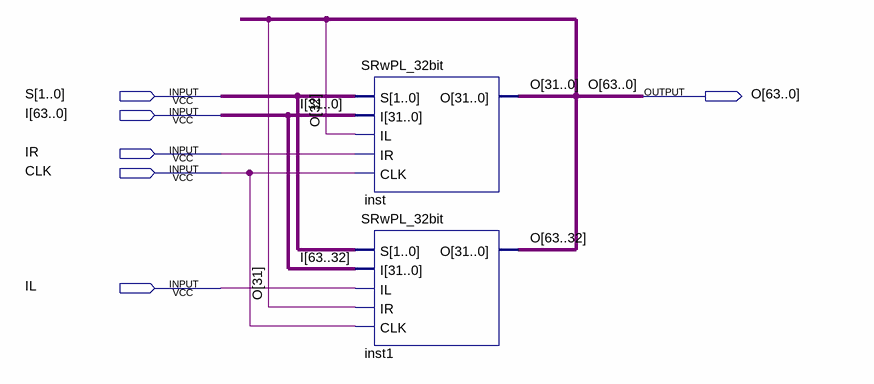
[diagram p0: schematic sheet]
// Quartus schematic SRwPL_64bits.bdf as structural Verilog: 2 symbols, 6 pins
module SRwPL_64bits (
  input  [1:0] S,
  input  [63:0] I,
  input  IR,
  input  CLK,
  input  IL,
  output [63:0] O
);

  SRwPL_32bit inst (.S(S), .I(I[31:0]), .IL(O[32]), .IR(IR), .CLK(CLK), .O(O[31:0]));
  SRwPL_32bit inst1 (.S(S), .I(I[63:32]), .IL(IL), .IR(O[31]), .CLK(CLK), .O(O[63:32]));
endmodule
